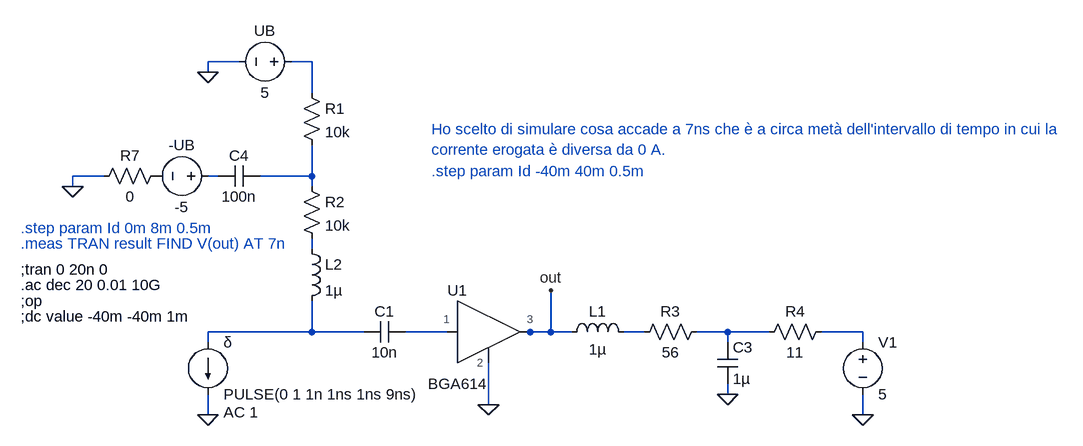
[diagram p0: schematic simulazione_preamp_Venezia_Giorgio.asc]
simulazione_preamp_Venezia_Giorgio.asc, the LTspice schematic file:
Version 4
SHEET 1 1568 680
WIRE -160 -320 -208 -320
WIRE -48 -320 -80 -320
WIRE -208 -304 -208 -320
WIRE -48 -272 -48 -320
WIRE -368 -144 -416 -144
WIRE -192 -144 -208 -144
WIRE -48 -144 -48 -192
WIRE -48 -144 -128 -144
WIRE -416 -128 -416 -144
WIRE -48 -128 -48 -144
WIRE -48 -32 -48 -48
WIRE -48 96 -48 48
WIRE -48 96 -208 96
WIRE 32 96 -48 96
WIRE 160 96 96 96
WIRE 288 96 272 96
WIRE 320 96 320 32
WIRE 320 96 288 96
WIRE 352 96 320 96
WIRE 464 96 432 96
WIRE 592 96 544 96
WIRE 656 96 592 96
WIRE 800 96 736 96
WIRE -208 112 -208 96
WIRE 592 112 592 96
WIRE 800 112 800 96
WIRE 592 192 592 176
WIRE 224 208 224 144
WIRE -208 224 -208 192
WIRE 800 224 800 192
FLAG 224 208 0
FLAG 592 192 0
FLAG 800 224 0
FLAG -208 -304 0
FLAG -208 224 0
FLAG -416 -128 0
FLAG 320 32 out
SYMBOL cap 96 80 R90
WINDOW 0 0 32 VBottom 2
WINDOW 3 32 32 VTop 2
SYMATTR InstName C1
SYMATTR Value 10n
SYMBOL ind 336 112 R270
WINDOW 0 32 56 VTop 2
WINDOW 3 5 56 VBottom 2
SYMATTR InstName L1
SYMATTR Value 1µ
SYMBOL res 560 80 R90
WINDOW 0 0 56 VBottom 2
WINDOW 3 32 56 VTop 2
SYMATTR InstName R3
SYMATTR Value 56
SYMBOL cap 576 112 R0
SYMATTR InstName C3
SYMATTR Value 1µ
SYMBOL res 752 80 R90
WINDOW 0 0 56 VBottom 2
WINDOW 3 32 56 VTop 2
SYMATTR InstName R4
SYMATTR Value 11
SYMBOL voltage 800 96 R0
WINDOW 123 0 0 Left 0
WINDOW 39 0 0 Left 0
SYMATTR InstName V1
SYMATTR Value 5
SYMBOL res -64 -288 R0
SYMATTR InstName R1
SYMATTR Value 10k
SYMBOL res -64 -144 R0
SYMATTR InstName R2
SYMATTR Value 10k
SYMBOL cap -128 -160 R90
WINDOW 0 0 32 VBottom 2
WINDOW 3 32 32 VTop 2
SYMATTR InstName C4
SYMATTR Value 100n
SYMBOL voltage -64 -320 R90
WINDOW 0 -32 56 VBottom 2
WINDOW 3 32 56 VTop 2
SYMATTR InstName UB
SYMATTR Value 5
SYMBOL voltage -192 -144 R90
WINDOW 0 -32 56 VBottom 2
WINDOW 3 32 56 VTop 2
SYMATTR InstName -UB
SYMATTR Value -5
SYMBOL current -208 112 R0
WINDOW 123 24 108 Left 2
WINDOW 39 0 0 Left 0
SYMATTR Value2 AC 1
SYMATTR InstName δ
SYMATTR Value PULSE(0 1 1n 1ns 1ns 9ns)
SYMBOL ind -64 -48 R0
SYMATTR InstName L2
SYMATTR Value 1µ
SYMBOL res -272 -160 R90
WINDOW 0 0 56 VBottom 2
WINDOW 3 32 56 VTop 2
SYMATTR InstName R7
SYMATTR Value 0
SYMBOL AutoGenerated\\BGA614 208 96 R0
SYMATTR InstName U1
TEXT -496 0 Left 2 !;tran 0 20n 0
TEXT -496 24 Left 2 !.ac dec 20 0.01 10G
TEXT -496 48 Left 2 !;op
TEXT -496 72 Left 2 !;dc value -40m -40m 1m
TEXT -496 -64 Left 2 ;.step param Id 0m 8m 0.5m
TEXT -496 -40 Left 2 ;.meas TRAN result FIND V(out) AT 7n
TEXT 136 -216 Left 2 ;Ho scelto di simulare cosa accade a 7ns che è a circa metà dell'intervallo di tempo in cui la\ncorrente erogata è diversa da 0 A.
TEXT 136 -152 Left 2 ;.step param Id -40m 40m 0.5m

The netlist it stands for:
* simulazione_preamp_Venezia_Giorgio.asc
C1 N006 N005 10n
L1 out N007 1µ
R3 N008 N007 56
C3 N008 0 1µ
R4 N009 N008 11
V1 N009 0 5
R1 N001 N003 10k
R2 N003 N004 10k
C4 N003 N002 100n
V§UB N001 0 5
V§-UB N002 P001 -5
I§δ N005 0 PULSE(0 1 1n 1ns 1ns 9ns) AC 1
L2 N004 N005 1µ
R7 P001 0 0
XU1 N006 0 out BGA614  ; pins 1 2 3
;tran 0 20n 0
.ac dec 20 0.01 10G
;op
;dc value -40m -40m 1m
* .step param Id 0m 8m 0.5m
* .meas TRAN result FIND V(out) AT 7n
* Ho scelto di simulare cosa accade a 7ns che è a circa metà dell'intervallo di tempo in cui la
* corrente erogata è diversa da 0 A.
* .step param Id -40m 40m 0.5m
.lib C:\Users\giorg\AppData\Local\LTspice\lib\sym\AutoGenerated\BGA614.net
.backanno
.end